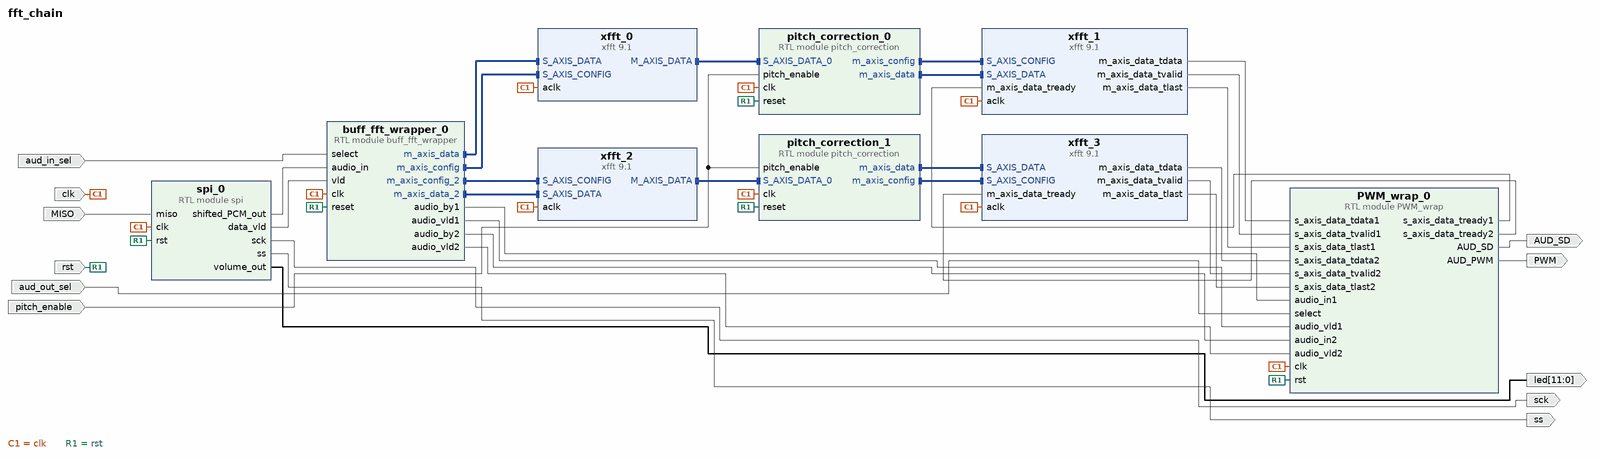
[diagram p0: block diagram of the top level]
# Vivado block design fft_chain, xc7a100tcsg324-1, Vivado 2018.3
create_bd_design fft_chain

create_bd_port -dir I -type clk clk
create_bd_port -dir I -type rst rst
create_bd_port -dir I MISO
create_bd_port -dir O sck
create_bd_port -dir O ss
create_bd_port -dir O -from 11 -to 0 led
create_bd_port -dir O PWM
create_bd_port -dir O AUD_SD
create_bd_port -dir I aud_in_sel
create_bd_port -dir I aud_out_sel
create_bd_port -dir I pitch_enable

create_bd_cell -type ip -vlnv xilinx.com:ip:xfft:9.1 xfft_0
set_property -dict [list \
  CONFIG.implementation_options pipelined_streaming_io \
  CONFIG.input_width 12 \
  CONFIG.number_of_stages_using_block_ram_for_data_and_phase_factors 1 \
  CONFIG.output_ordering natural_order \
  CONFIG.transform_length 256 \
] [get_bd_cells xfft_0]
create_bd_cell -type ip -vlnv xilinx.com:ip:xfft:9.1 xfft_1
set_property -dict [list \
  CONFIG.implementation_options pipelined_streaming_io \
  CONFIG.input_width 12 \
  CONFIG.number_of_stages_using_block_ram_for_data_and_phase_factors 1 \
  CONFIG.output_ordering natural_order \
  CONFIG.transform_length 256 \
] [get_bd_cells xfft_1]
create_bd_cell -type ip -vlnv xilinx.com:ip:xfft:9.1 xfft_2
set_property -dict [list \
  CONFIG.implementation_options pipelined_streaming_io \
  CONFIG.input_width 12 \
  CONFIG.number_of_stages_using_block_ram_for_data_and_phase_factors 1 \
  CONFIG.output_ordering natural_order \
  CONFIG.transform_length 256 \
] [get_bd_cells xfft_2]
create_bd_cell -type ip -vlnv xilinx.com:ip:xfft:9.1 xfft_3
set_property -dict [list \
  CONFIG.implementation_options pipelined_streaming_io \
  CONFIG.input_width 12 \
  CONFIG.number_of_stages_using_block_ram_for_data_and_phase_factors 1 \
  CONFIG.output_ordering natural_order \
  CONFIG.transform_length 256 \
] [get_bd_cells xfft_3]
create_bd_cell -type module -reference spi spi_0
create_bd_cell -type module -reference PWM_wrap PWM_wrap_0
create_bd_cell -type module -reference buff_fft_wrapper buff_fft_wrapper_0
create_bd_cell -type module -reference pitch_correction pitch_correction_0
create_bd_cell -type module -reference pitch_correction pitch_correction_1

# ---- connections ----

connect_bd_intf_net [get_bd_intf_pins buff_fft_wrapper_0/m_axis_config_2] [get_bd_intf_pins xfft_2/S_AXIS_CONFIG]
connect_bd_intf_net [get_bd_intf_pins xfft_0/M_AXIS_DATA] [get_bd_intf_pins pitch_correction_0/S_AXIS_DATA_0]
connect_bd_intf_net [get_bd_intf_pins pitch_correction_1/m_axis_data] [get_bd_intf_pins xfft_3/S_AXIS_DATA]
connect_bd_intf_net [get_bd_intf_pins pitch_correction_0/m_axis_config] [get_bd_intf_pins xfft_1/S_AXIS_CONFIG]
connect_bd_intf_net [get_bd_intf_pins buff_fft_wrapper_0/m_axis_data] [get_bd_intf_pins xfft_0/S_AXIS_DATA]
connect_bd_intf_net [get_bd_intf_pins pitch_correction_0/m_axis_data] [get_bd_intf_pins xfft_1/S_AXIS_DATA]
connect_bd_intf_net [get_bd_intf_pins pitch_correction_1/m_axis_config] [get_bd_intf_pins xfft_3/S_AXIS_CONFIG]
connect_bd_intf_net [get_bd_intf_pins xfft_2/M_AXIS_DATA] [get_bd_intf_pins pitch_correction_1/S_AXIS_DATA_0]
connect_bd_intf_net [get_bd_intf_pins buff_fft_wrapper_0/m_axis_config] [get_bd_intf_pins xfft_0/S_AXIS_CONFIG]
connect_bd_intf_net [get_bd_intf_pins buff_fft_wrapper_0/m_axis_data_2] [get_bd_intf_pins xfft_2/S_AXIS_DATA]
connect_bd_net -net clk_0_1 [get_bd_ports clk] \
  [get_bd_pins xfft_0/aclk] [get_bd_pins xfft_1/aclk] [get_bd_pins xfft_2/aclk] [get_bd_pins xfft_3/aclk] \
  [get_bd_pins spi_0/clk] [get_bd_pins PWM_wrap_0/clk] [get_bd_pins buff_fft_wrapper_0/clk] \
  [get_bd_pins pitch_correction_0/clk] [get_bd_pins pitch_correction_1/clk]
connect_bd_net -net rst_0_1 [get_bd_ports rst] \
  [get_bd_pins spi_0/rst] [get_bd_pins PWM_wrap_0/rst] [get_bd_pins buff_fft_wrapper_0/reset] \
  [get_bd_pins pitch_correction_0/reset] [get_bd_pins pitch_correction_1/reset]
connect_bd_net [get_bd_pins spi_0/shifted_PCM_out] [get_bd_pins buff_fft_wrapper_0/audio_in]
connect_bd_net [get_bd_pins spi_0/data_vld] [get_bd_pins buff_fft_wrapper_0/vld]
connect_bd_net -net miso_0_1 [get_bd_ports MISO] [get_bd_pins spi_0/miso]
connect_bd_net [get_bd_pins spi_0/sck] [get_bd_ports sck]
connect_bd_net [get_bd_pins spi_0/ss] [get_bd_ports ss]
connect_bd_net [get_bd_pins spi_0/volume_out] [get_bd_ports led]
connect_bd_net -net select_0_1 [get_bd_ports aud_in_sel] [get_bd_pins buff_fft_wrapper_0/select]
connect_bd_net [get_bd_pins xfft_1/m_axis_data_tdata] [get_bd_pins PWM_wrap_0/s_axis_data_tdata1]
connect_bd_net [get_bd_pins PWM_wrap_0/s_axis_data_tready1] [get_bd_pins xfft_1/m_axis_data_tready]
connect_bd_net [get_bd_pins xfft_1/m_axis_data_tvalid] [get_bd_pins PWM_wrap_0/s_axis_data_tvalid1]
connect_bd_net [get_bd_pins xfft_3/m_axis_data_tdata] [get_bd_pins PWM_wrap_0/s_axis_data_tdata2]
connect_bd_net [get_bd_pins xfft_3/m_axis_data_tvalid] [get_bd_pins PWM_wrap_0/s_axis_data_tvalid2]
connect_bd_net [get_bd_pins PWM_wrap_0/s_axis_data_tready2] [get_bd_pins xfft_3/m_axis_data_tready]
connect_bd_net [get_bd_pins xfft_3/m_axis_data_tlast] [get_bd_pins PWM_wrap_0/s_axis_data_tlast2]
connect_bd_net [get_bd_pins xfft_1/m_axis_data_tlast] [get_bd_pins PWM_wrap_0/s_axis_data_tlast1]
connect_bd_net [get_bd_pins PWM_wrap_0/AUD_PWM] [get_bd_ports PWM]
connect_bd_net [get_bd_pins PWM_wrap_0/AUD_SD] [get_bd_ports AUD_SD]
connect_bd_net [get_bd_ports aud_out_sel] [get_bd_pins PWM_wrap_0/select]
connect_bd_net [get_bd_pins buff_fft_wrapper_0/audio_by1] [get_bd_pins PWM_wrap_0/audio_in1]
connect_bd_net [get_bd_pins buff_fft_wrapper_0/audio_vld1] [get_bd_pins PWM_wrap_0/audio_vld1]
connect_bd_net [get_bd_pins buff_fft_wrapper_0/audio_by2] [get_bd_pins PWM_wrap_0/audio_in2]
connect_bd_net [get_bd_pins buff_fft_wrapper_0/audio_vld2] [get_bd_pins PWM_wrap_0/audio_vld2]
connect_bd_net -net pitch_enable_0_1 [get_bd_ports pitch_enable] \
  [get_bd_pins pitch_correction_0/pitch_enable] [get_bd_pins pitch_correction_1/pitch_enable]

validate_bd_design
save_bd_design
